# Altium schematic sheet 4 inverter.SchDoc
size A4; SheetNumber: 4; SheetTotal: 6
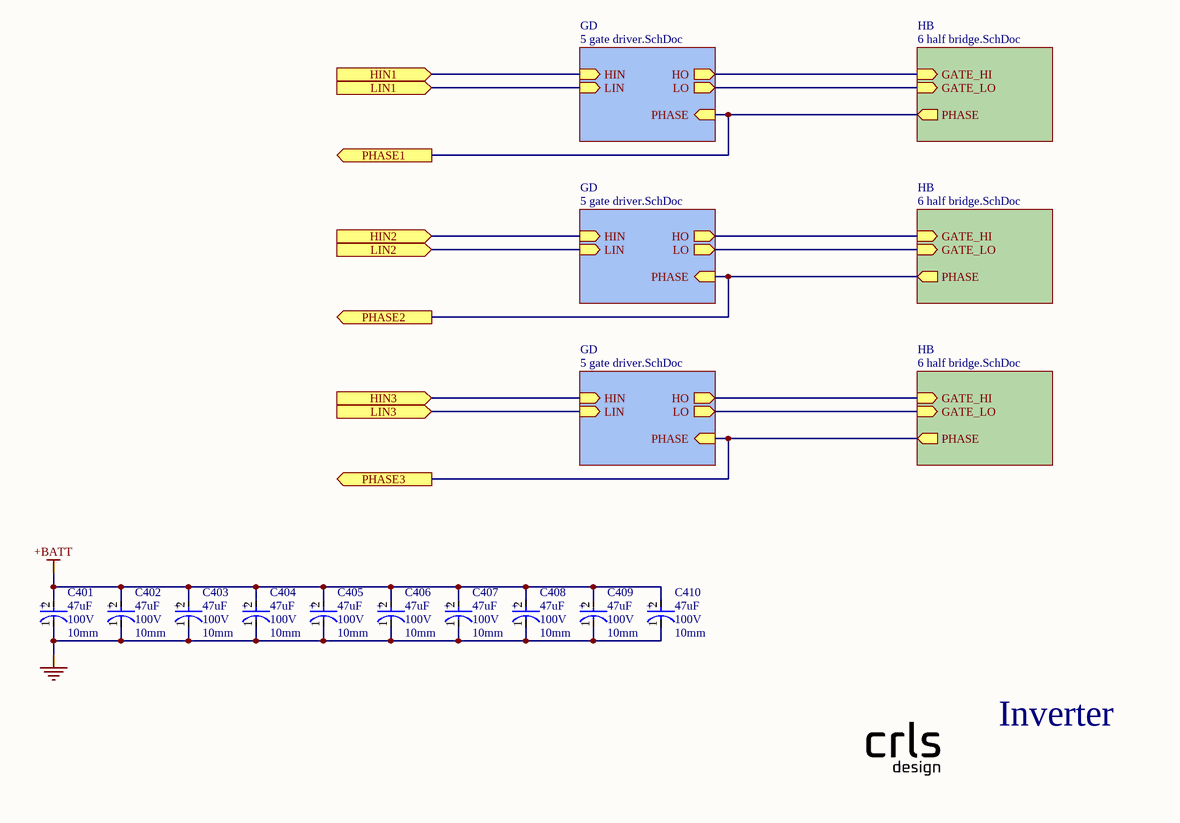
[diagram p0: 4 inverter.SchDoc]

## Parts
C401  Voltage Rating: 100V  Length: 10mm  Capacitance: 47uF  [FP-UUX2A470MNL1GS-MFG]  (hidden comment: UUX2A470MNL1GS)
C402  Voltage Rating: 100V  Length: 10mm  Capacitance: 47uF  [FP-UUX2A470MNL1GS-MFG]  (hidden comment: UUX2A470MNL1GS)
C403  Voltage Rating: 100V  Length: 10mm  Capacitance: 47uF  [FP-UUX2A470MNL1GS-MFG]  (hidden comment: UUX2A470MNL1GS)
C404  Voltage Rating: 100V  Length: 10mm  Capacitance: 47uF  [FP-UUX2A470MNL1GS-MFG]  (hidden comment: UUX2A470MNL1GS)
C405  Voltage Rating: 100V  Length: 10mm  Capacitance: 47uF  [FP-UUX2A470MNL1GS-MFG]  (hidden comment: UUX2A470MNL1GS)
C406  Voltage Rating: 100V  Length: 10mm  Capacitance: 47uF  [FP-UUX2A470MNL1GS-MFG]  (hidden comment: UUX2A470MNL1GS)
C407  Voltage Rating: 100V  Length: 10mm  Capacitance: 47uF  [FP-UUX2A470MNL1GS-MFG]  (hidden comment: UUX2A470MNL1GS)
C408  Voltage Rating: 100V  Length: 10mm  Capacitance: 47uF  [FP-UUX2A470MNL1GS-MFG]  (hidden comment: UUX2A470MNL1GS)
C409  Voltage Rating: 100V  Length: 10mm  Capacitance: 47uF  [FP-UUX2A470MNL1GS-MFG]  (hidden comment: UUX2A470MNL1GS)
C410  Voltage Rating: 100V  Length: 10mm  Capacitance: 47uF  [FP-UUX2A470MNL1GS-MFG]  (hidden comment: UUX2A470MNL1GS)

## Sub-sheets
GD = 5 gate driver.SchDoc: HIN (in), LIN (in), HO (out), LO (out), PHASE (in)
GD = 5 gate driver.SchDoc: HIN (in), LIN (in), HO (out), LO (out), PHASE (in)
GD = 5 gate driver.SchDoc: HIN (in), LIN (in), HO (out), LO (out), PHASE (in)
HB = 6 half bridge.SchDoc: GATE_HI (in), GATE_LO (in), PHASE (out)
HB = 6 half bridge.SchDoc: GATE_HI (in), GATE_LO (in), PHASE (out)
HB = 6 half bridge.SchDoc: GATE_HI (in), GATE_LO (in), PHASE (out)

## Ports
HIN1 (in), HIN2 (in), HIN3 (in), LIN1 (in), LIN2 (in), LIN3 (in), PHASE1 (out), PHASE2 (out), PHASE3 (out)

## Nets
+BATT: C401.2(A) C402.2(A) C403.2(A) C404.2(A) C405.2(A) C406.2(A) C407.2(A) C408.2(A) C409.2(A) C410.2(A)
GND: C401.1(C) C402.1(C) C403.1(C) C404.1(C) C405.1(C) C406.1(C) C407.1(C) C408.1(C) C409.1(C) C410.1(C)
HIN1: port HIN1, sheet GD/HIN
HIN2: port HIN2, sheet GD/HIN
HIN3: port HIN3, sheet GD/HIN
LIN1: port LIN1, sheet GD/LIN
LIN2: port LIN2, sheet GD/LIN
LIN3: port LIN3, sheet GD/LIN
PHASE1: port PHASE1, sheet HB/PHASE, sheet GD/PHASE
PHASE2: port PHASE2, sheet HB/PHASE, sheet GD/PHASE
PHASE3: port PHASE3, sheet HB/PHASE, sheet GD/PHASE
(unnamed): sheet HB/GATE_HI, sheet GD/HO
(unnamed): sheet HB/GATE_LO, sheet GD/LO
(unnamed): sheet HB/GATE_HI, sheet GD/HO
(unnamed): sheet HB/GATE_LO, sheet GD/LO
(unnamed): sheet HB/GATE_HI, sheet GD/HO
(unnamed): sheet HB/GATE_LO, sheet GD/LO

## Notes on the sheet
- Inverter
- (in symbol CMP-2000-07372-2) +

## Library data of the parts
C401-C410 = CMP-2000-07372-2: CAP ALUM 47UF 20% 100V SMD; Life (Hours): 2000Hour; Ripple Current (AC): 230mA; Dissipation Factor: 0.08%; Leakage Current: 141uA; Lead Diameter: 1.1mm; Diameter: 10mm; Termination: SMD/SMT; Voltage: 100V; Tolerance: 20%; Packaging: Tape and Reel; Height - Seated (Max): 0.394inch; Case/Package: Radial; Features: General Purpose; Lead Pitch: 4.5mm; Height: 10mm; Min Operating Temperature: -55°C; REACH SVHC: No SVHC; Radiation Hardening: No; RoHS Compliant: Yes; Construction: Cylindrical; Package Quantity: 500; Voltage Rating (DC): 100V; Ripple Current: 230mA; Series: UX; Max Operating Temperature: 105°C; Mount: Surface Mount